# Altium schematic sheet HV_DAC_1PPM.SchDoc: HV DAC 1ppm
size A3; Author: M.Beldyga; CompanyName: WUT ISE; DrawnBy: M.Beldyga; Organization: WUT ISE; Address1: PW ISE; Address2: Nowowiejska 15/19 00-665 Warsaw; Address3: micbeldyga@gmail.com; SheetNumber: 1; SheetTotal: 7; ModifiedBy: -; CheckedDate: -; DivGrp: WUT ISE; Designer: M.Beldyga; ModifiedDate: -; ProjectName: Sensor Box
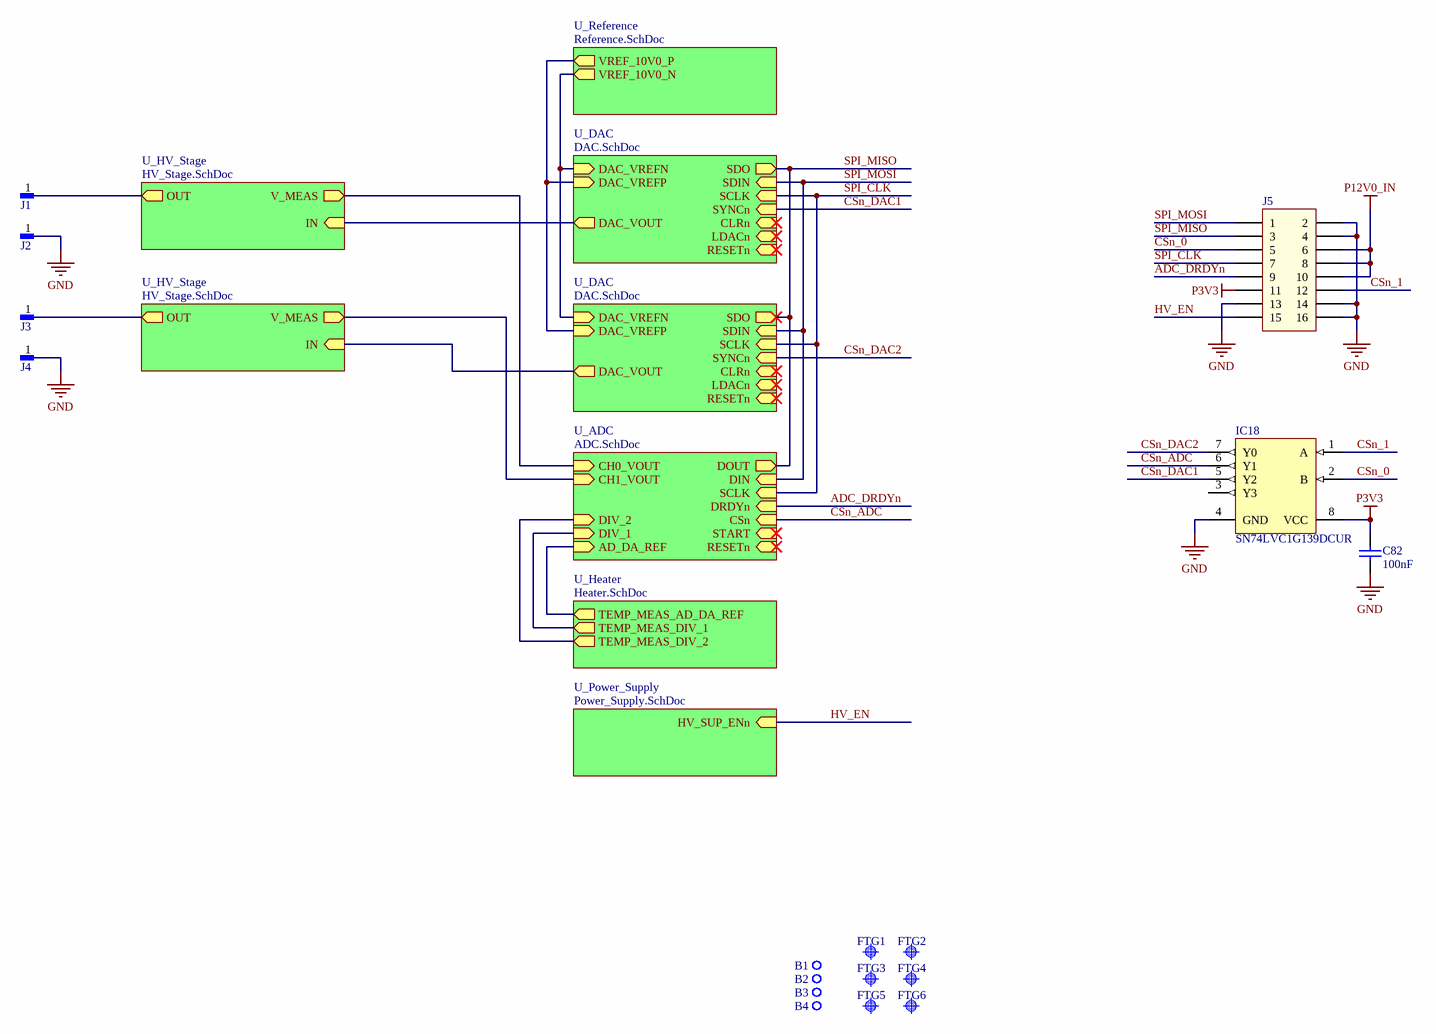
[diagram p0: HV_DAC_1PPM.SchDoc]

## Parts
B1  Plated Hole  [MTG270_500]  (value not drawn)  (no BOM)
B2  Plated Hole  [MTG270_500]  (value not drawn)  (no BOM)
B3  Plated Hole  [MTG270_500]  (value not drawn)  (no BOM)
B4  Plated Hole  [MTG270_500]  (value not drawn)  (no BOM)
C82  100nF  [CAPC1005X55N]
FTG1  Use only in PCB  [FIDUCIAL_TOP_S100-200]  (value not drawn)  (no BOM)
FTG2  Use only in PCB  [FIDUCIAL_TOP_S100-200]  (value not drawn)  (no BOM)
FTG3  Use only in PCB  [FIDUCIAL_TOP_S100-200]  (value not drawn)  (no BOM)
FTG4  Use only in PCB  [FIDUCIAL_TOP_S100-200]  (value not drawn)  (no BOM)
FTG5  Use only in PCB  [FIDUCIAL_TOP_S100-200]  (value not drawn)  (no BOM)
FTG6  Use only in PCB  [FIDUCIAL_TOP_S100-200]  (value not drawn)  (no BOM)
IC18  SN74LVC1G139DCUR  [TSSOP50P310X90-8N]
J1  SMD Pad  [R400X300]  (value not drawn)
J2  SMD Pad  [R400X300]  (value not drawn)
J3  SMD Pad  [R400X300]  (value not drawn)
J4  SMD Pad  [R400X300]  (value not drawn)
J5  2.00 mm_SMT_Vertical_16 pin  [62131621821]  (value not drawn)

## Sub-sheets
U_ADC = ADC.SchDoc: SCLK (in), DIN (in), DRDYn (in), DOUT (out), CSn (in), START (in), RESETn (in), CH0_VOUT (in), CH1_VOUT (in), AD_DA_REF (in), DIV_1 (in), DIV_2 (in)
U_DAC = DAC.SchDoc: SDIN (in), SCLK (in), SYNCn (in), SDO (out), CLRn (in), LDACn (in), RESETn (in), DAC_VREFN (in), DAC_VREFP (in), DAC_VOUT (out)
U_DAC = DAC.SchDoc: SDIN (in), SCLK (in), SYNCn (in), SDO (out), CLRn (in), LDACn (in), RESETn (in), DAC_VREFN (in), DAC_VREFP (in), DAC_VOUT (out)
U_Heater = Heater.SchDoc: TEMP_MEAS_AD_DA_REF (out), TEMP_MEAS_DIV_1 (out), TEMP_MEAS_DIV_2 (out)
U_HV_Stage = HV_Stage.SchDoc: IN (in), OUT (out), V_MEAS (out)
U_HV_Stage = HV_Stage.SchDoc: IN (in), OUT (out), V_MEAS (out)
U_Power_Supply = Power_Supply.SchDoc: HV_SUP_ENn (in)
U_Reference = Reference.SchDoc: VREF_10V0_P (out), VREF_10V0_N (out)

## Nets
GND: C82.1 IC18.4(GND) J2.1 J4.1 J5.2 J5.4 J5.13 J5.14 J5.16
P3V3: C82.2 IC18.8(VCC) J5.11
P12V0_IN: J5.6 J5.8 J5.10
ADC_DRDYn: J5.9 ; sheet U_ADC/DRDYn
CSn_0: IC18.2(B) J5.5
CSn_1: IC18.1(A) J5.12
CSn_ADC: IC18.6(Y1) ; sheet U_ADC/CSn
CSn_DAC1: IC18.5(Y2) ; sheet U_DAC/SYNCn
CSn_DAC2: IC18.7(Y0) ; sheet U_DAC/SYNCn
HV_EN: J5.15 ; sheet U_Power_Supply/HV_SUP_ENn
SPI_CLK: J5.7 ; sheet U_ADC/SCLK, sheet U_DAC/SCLK, sheet U_DAC/SCLK
SPI_MISO: J5.3 ; sheet U_ADC/DOUT, sheet U_DAC/SDO, sheet U_DAC/SDO
SPI_MOSI: J5.1 ; sheet U_ADC/DIN, sheet U_DAC/SDIN, sheet U_DAC/SDIN
NetJ1_1: J1.1 ; sheet U_HV_Stage/OUT
NetJ3_1: J3.1 ; sheet U_HV_Stage/OUT
(unnamed): sheet U_ADC/CH0_VOUT, sheet U_HV_Stage/V_MEAS
(unnamed): sheet U_ADC/CH1_VOUT, sheet U_HV_Stage/V_MEAS
(unnamed): sheet U_ADC/AD_DA_REF, sheet U_Heater/TEMP_MEAS_AD_DA_REF
(unnamed): sheet U_ADC/DIV_1, sheet U_Heater/TEMP_MEAS_DIV_1
(unnamed): sheet U_ADC/DIV_2, sheet U_Heater/TEMP_MEAS_DIV_2
(unnamed): sheet U_DAC/DAC_VREFN, sheet U_Reference/VREF_10V0_N, sheet U_DAC/DAC_VREFN
(unnamed): sheet U_DAC/DAC_VREFP, sheet U_Reference/VREF_10V0_P, sheet U_DAC/DAC_VREFP
(unnamed): sheet U_DAC/DAC_VOUT, sheet U_HV_Stage/IN
(unnamed): sheet U_HV_Stage/IN, sheet U_DAC/DAC_VOUT

Not connected (* = marked no-connect by the designer): B1 1; B2 1; B3 1; B4 1; IC18 3(Y3)

## Notes on the sheet
- Project/Equipment
- Document
- Designer
- Drawn by
- Check.by
- Contact
- File
- Last Mod.
- Print Date
- Sheet
- Size
- A3
- of
- Rev

## Library data of the parts
B1-B4 = PLATED_HOLE2.7_PAD5.0: Single Terminal Socket; Part Description: Plated Through Hole: Hole Dia.=2.7mm Pad Dia.=5.0mm; Mounted: No; Part Number: PLATED_HOLE2.7_PAD5.0; Component Type: Standard (No BOM); Pin Count: 1; Family: Plated Hole; Socket: No; SMD: No; Sense: No; Status: None; ComponentHeight: 0mm; HelpURL: Undefined; Author: CERN DEM JMW; CreateDate: 27.09.2011; LatestRevisionDate: 27.09.2011; PackageDescription: Plated Through Hole: Hole Dia.=2.7mm Pad Dia.=5.0mm
C82 = CC0402_100NF_50V_10%_X7R: Non-polarised capacitor; Part Description: SMD Multilayer Chip Ceramic Capacitor; Manufacturer: GENERIC; Manufacturer1 Part Number: GRM155R71H104KE14D; Voltage: 50V; TC: X7R; Tolerance: ±10%; Part Number: CC0402_100NF_50V_10%_X7R; Component Kind: Standard; Component Type: Standard; Pin Count: 2; Value: 100nF; Status: None; Manufacturer Part Number: CC0402_100NF_50V_10%_X7R; Case: 0402; Mounted: Yes; Socket: No; SMD: Yes; Sense: No; Manufacturer1 Example: MURATA; Manufacturer1 ComponentHeight: 0.55mm; HelpURL: \\cern.ch\dfs\Applications\Altium\Datasheets\CC0402_MURATA_GRM155R71H104KE14D.pdf; Author: CERN DEM MR; CreateDate: 6/30/2017; LatestRevisionDate: 6/30/2017
FTG1-FTG6 = FIDUCIAL_TARGET_S100-200: Fiducial Target; Part Description: Square Fiducial Target, Top Layer, 1.0mm, Top Solder 2.0mm, Keepout =2.0mm; Mounted: No; Part Number: FIDUCIAL_TARGET_S100-200; Component Type: Standard (No BOM); Pin Count: 1; Family: Fiducial; Socket: No; SMD: Yes; Sense: No; Status: None; ComponentHeight: 0mm; HelpURL: Undefined; Author: CERN DEM JLC; CreateDate: 09.02.2010; LatestRevisionDate: 04.04.2012; PackageDescription: Square Fiducial Target, Top Layer, 1.0mm, Top Solder 2.0mm, Keepout =2.0mm
IC18 = SN74LVC1G139DCUR: IC DECODER/DEMUX 1X2: 4 8VSSOP Decoder/Demultiplexer 1 x 2: 4 8-VSSOP; Manufacturer: Texas Instruments; Number of Outputs: 4; Number of Bits: 1; Logic Function: Decoder,Demultiplexer; Number of Inputs: 2; Propagation Delay: 16.7ns; Max Supply Voltage: 5.5V; Min Supply Voltage: 1.65V; High Level Output Current: 32mA; Polarity: Inverting; Quiescent Current: 10uA; Supply Type: Single; Throw Configuration: 4340Throw Configuration; Number of Channels: 1NUMBER; Supplier: Mouser; Supplier Part Number: 595-SN74LVC1G139DCUR; Manufacturer Part Number: SN74LVC1G139DCUR; RoHS: Yes; Category: Integrated Circuits (ICs); Stock: 29396; Pricing: 1=0.38, 10=0.261, 50=0.235, 100=0.207, 1000=0.178, 10000=0.158 (USD); Mounting Technology: Surface Mount; Case/Package: VSSOP; Pins: 8; Weight: 0.000339oz; Min Operating Temperature: -40°C; Max Operating Temperature: 85°C; Packaging: Tape and Reel; Number of Circuits: 1; Number of Elements: 1; Low Level Output Current: 32mA; Number of Input Lines: 2; Number of Output Lines: 4; Independent Circuits: 1; Series: 74LVC; Technology: CMOS; Length: 2.3mm; Width: 2mm; Height: 900um; Thickness: 850um; Reach SVHC Compliant: No; Lead Free: 5697LeadFree; RoHS Compliant: Yes; ComponentLink1URL: https://datasheet.ciiva.com/1888/sn74lvc1g139-1888859.pdf?src-supplier=Digikey; ComponentLink1Description: https://datasheet.ciiva.com/1888/sn74lvc1g139-1888859.pdf?src-supplier=Digikey; ComponentLink2URL: https://datasheet.ciiva.com/1888/sn74lvc1g139-1888860.pdf?src-supplier=Digikey; ComponentLink2Description: https://datasheet.ciiva.com/1888/sn74lvc1g139-1888860.pdf?src-supplier=Digikey; ComponentLink3URL: https://datasheet.ciiva.com/14293/sn74lvc1g139-14293589.pdf?src-supplier=Avnet; ComponentLink3Description: https://datasheet.ciiva.com/14293/sn74lvc1g139-14293589.pdf?src-supplier=Avnet; ComponentLink4URL: https://datasheet.ciiva.com/14294/sn74lvc1g139-14294935.pdf?src-supplier=Avnet; ComponentLink4Description: https://datasheet.ciiva.com/14294/sn74lvc1g139-14294935.pdf?src-supplier=Avnet; ComponentLink5URL: https://datasheet.ciiva.com/46430/1847422-46430989.pdf?src-supplier=Element14; ComponentLink5Description: https://datasheet.ciiva.com/46430/1847422-46430989.pdf?src-supplier=Element14
J1-J4 = SMD_PAD_4X3MM: Pad; Part Description: 4mm x 3mm SMD Pad; Mounted: No; Part Number: SMD_PAD_4X3MM; Component Kind: Standard (No BOM); Component Type: Standard (No BOM); Pin Count: 1; Family: SMD Pad; Socket: No; SMD: Yes; Sense: No; Status: None; ComponentHeight: 0mm; HelpURL: Undefined; Author: CERN DEM JLC; CreateDate: 3/15/2010; LatestRevisionDate: 3/15/2010; PackageDescription: 4mm x  3mm SMD Pad
J5 = 62131621821: Socket Header WR-PHD, Pitch 2.00 mm, SMT, Vertical, dual row, 16 pin; Rated Current: 2 A; Pin Number: 16; Pitch: 2.00 mm; Working Voltage: 200 VAC; Contact Resistance: 20 mOhm; Insulation Resistance: >1000 MOhm; ComponentLink1Description: Manufacturer; ComponentLink1URL: http://www.we-online.de; ComponentLink2Description: Datasheet; ComponentLink2URL: http://katalog.we-online.com/em/datasheet/62131621821.pdf; Part Number: 62131621821; Published Date: Jan. 2018; Publisher: Wurth Elektronik; Operating Temperature: -40 to 105 degC; Mounting Technology: SMT; Row Number: dual; Orientation: Vertical